# Altium schematic sheet RS19ToIDC.SchDoc
size A4; SheetNumber: 1; SheetTotal: 1
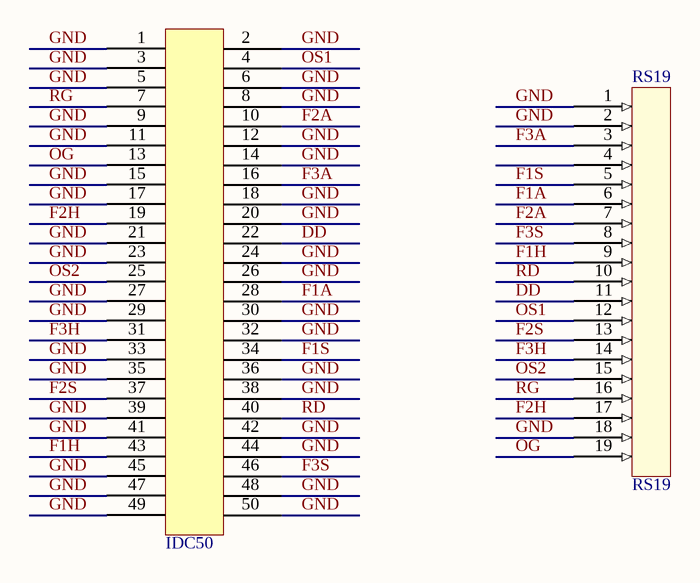
[diagram p0: RS19ToIDC.SchDoc]

## Parts
(Parts that share a designator on the sheet are numbered #1, #2 ... from top to bottom, then left to right.)
*#1  IDC50  [IDC50]
*#2  RS19  [RS19]

## Nets
DD: *#1.22 *#2.11
F1A: *#1.28 *#2.6
F1H: *#1.43 *#2.9
F1S: *#1.34 *#2.5
F2A: *#1.10 *#2.7
F2H: *#1.19 *#2.17
F2S: *#1.37 *#2.13
F3A: *#1.16 *#2.3
F3H: *#1.31 *#2.14
F3S: *#1.46 *#2.8
GND: *#1.1 *#1.2 *#1.3 *#1.5 *#1.6 *#1.8 *#1.9 *#1.11 *#1.12 *#1.14 *#1.15 *#1.17 *#1.18 *#1.20 *#1.21 *#1.23 *#1.24 *#1.26 *#1.27 *#1.29 *#1.30 *#1.32 *#1.33 *#1.35 *#1.36 *#1.38 *#1.39 *#1.41 *#1.42 *#1.44 *#1.45 *#1.47 *#1.48 *#1.49 *#1.50 *#2.1 *#2.2 *#2.18
OG: *#1.13 *#2.19
OS1: *#1.4 *#2.12
OS2: *#1.25 *#2.15
RD: *#1.40 *#2.10
RG: *#1.7 *#2.16

Not connected (* = marked no-connect by the designer): *#2 4